# EAGLE schematic MD_proto (EAGLE 9.0.0)
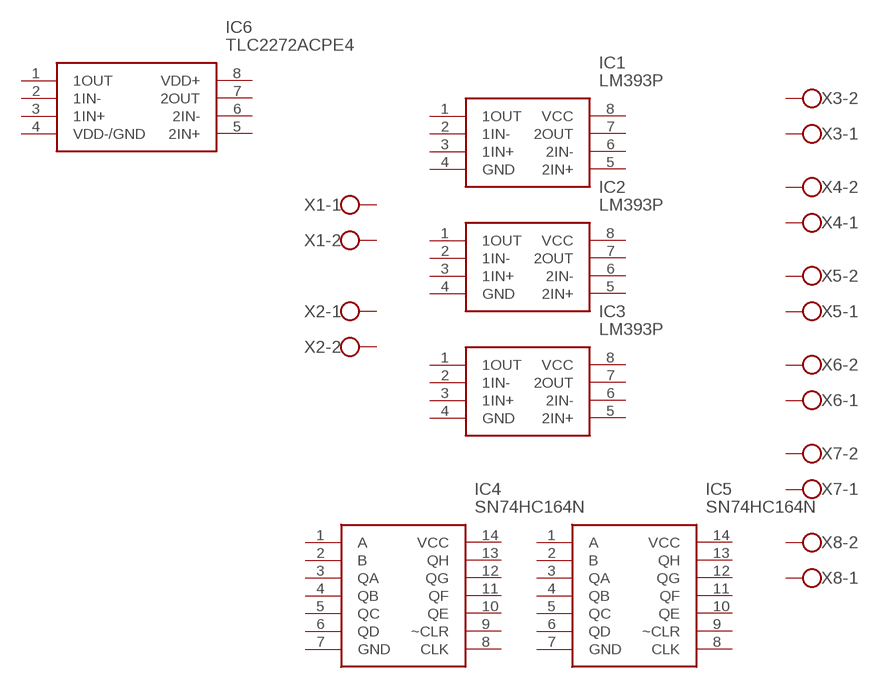
[diagram p0: schematic, sheet 1]

## Parts
IC1  LM393P  [DIP794W53P254L959H508Q8N]
IC2  LM393P  [DIP794W53P254L959H508Q8N]
IC3  LM393P  [DIP794W53P254L959H508Q8N]
IC4  SN74HC164N  [DIP254P762X508-14]
IC5  SN74HC164N  [DIP254P762X508-14]
IC6  TLC2272ACPE4  [DIP794W53P254L959H508Q8N]
X1  W237-102  [W237-102]
X2  W237-102  [W237-102]
X3  W237-102  [W237-102]
X4  W237-102  [W237-102]
X5  W237-102  [W237-102]
X6  W237-102  [W237-102]
X7  W237-102  [W237-102]
X8  W237-102  [W237-102]
Unconnected: IC1.1(1OUT) IC1.2(1IN-) IC1.3(1IN+) IC1.5(2IN+) IC1.6(2IN-) IC1.7(2OUT) IC2.1(1OUT) IC2.2(1IN-) IC2.3(1IN+) IC2.5(2IN+) IC2.6(2IN-) IC2.7(2OUT) IC3.1(1OUT) IC3.2(1IN-) IC3.3(1IN+) IC3.5(2IN+) IC3.6(2IN-) IC3.7(2OUT) IC4.1(A) IC4.2(B) IC4.3(QA) IC4.4(QB) IC4.5(QC) IC4.6(QD) IC4.7(GND) IC4.8(CLK) IC4.9(~CLR) IC4.10(QE) IC4.11(QF) IC4.12(QG) IC4.13(QH) IC4.14(VCC) IC5.1(A) IC5.2(B) IC5.3(QA) IC5.4(QB) IC5.5(QC) IC5.6(QD) IC5.7(GND) IC5.8(CLK) IC5.9(~CLR) IC5.10(QE) IC5.11(QF) IC5.12(QG) IC5.13(QH) IC5.14(VCC) IC6.1(1OUT) IC6.2(1IN-) IC6.3(1IN+) IC6.5(2IN+) IC6.6(2IN-) IC6.7(2OUT) X1.1 X1.2 X2.1 X2.2 X3.1 X3.2 X4.1 X4.2 X5.1 X5.2 X6.1 X6.2 X7.1 X7.2 X8.1 X8.2

## Power pins joined to a net without a drawn wire
GND: IC1.4(GND) IC2.4(GND) IC3.4(GND)
VCC: IC1.8(VCC) IC2.8(VCC) IC3.8(VCC)
VDD+: IC6.8(VDD+)
VDD-/GND: IC6.4(VDD-/GND)

## Library data of the parts
IC1-IC3 = rasm_parts:LM393P: LM393P, Dual Comparator Open Collector 1.3s 12 V, 15 V, 18 V, 24 V, 28 V, 3 V, 5 V, 9 V 8-Pin PDIP Source: Datasheet <http://www.ti.com/lit/ds/symlink/lm393.pdf>; ARROW_PART_NUMBER: LM393P; ARROW_PRICE/STOCK: https://www.arrow.com/en/products/lm393p/texas-instruments; DESCRIPTION: LM393P, Dual Comparator Open Collector 1.3s 12 V, 15 V, 18 V, 24 V, 28 V, 3 V, 5 V, 9 V 8-Pin PDIP; HEIGHT: 5.08mm; MANUFACTURER_NAME: Texas Instruments; MANUFACTURER_PART_NUMBER: LM393P; RS_PART_NUMBER: 0810239; RS_PRICE/STOCK: http://uk.rs-online.com/web/p/products/0810239
IC4 IC5 = rasm_parts:SN74HC164N: 8-BIT PARALLEL-OUT SERIAL SHIFT REGISTERS Source: Datasheet <http://www.ti.com/lit/gpn/sn74hc164>; ARROW_PART_NUMBER: SN74HC164N; ARROW_PRICE/STOCK: https://www.arrow.com/en/products/sn74hc164n/texas-instruments; DESCRIPTION: 8-BIT PARALLEL-OUT SERIAL SHIFT REGISTERS; HEIGHT: mm; MANUFACTURER_NAME: Texas Instruments; MANUFACTURER_PART_NUMBER: SN74HC164N; RS_PART_NUMBER: 2175594; RS_PRICE/STOCK: http://uk.rs-online.com/web/p/products/2175594
IC6 = rasm_parts:TLC2272ACPE4: TLC2272ACPE4, Dual Operational Amplifier 2.18MHz CMOS, Rail-Rail 5 to 15V, 8-Pin PDIP Source: Datasheet <http://www.ti.com/lit/ds/symlink/tlc2272a.pdf>; ARROW_PART_NUMBER: TLC2272ACPE4; ARROW_PRICE/STOCK: http://uk.rs-online.com/web/p/products/7092132P; DESCRIPTION: TLC2272ACPE4, Dual Operational Amplifier 2.18MHz CMOS, Rail-Rail 5 to 15V, 8-Pin PDIP; HEIGHT: 5.08mm; MANUFACTURER_NAME: Texas Instruments; MANUFACTURER_PART_NUMBER: TLC2272ACPE4; RS_PART_NUMBER: 7092132P; RS_PRICE/STOCK: http://uk.rs-online.com/web/p/products/7092132P
X1-X8 = con-wago-500:W237-102: WAGO SCREW CLAMP; MPN: 237-102; OC_FARNELL: unknown; OC_NEWARK: 70K9898